# EAGLE design IO top board (EAGLE 9.6.2)
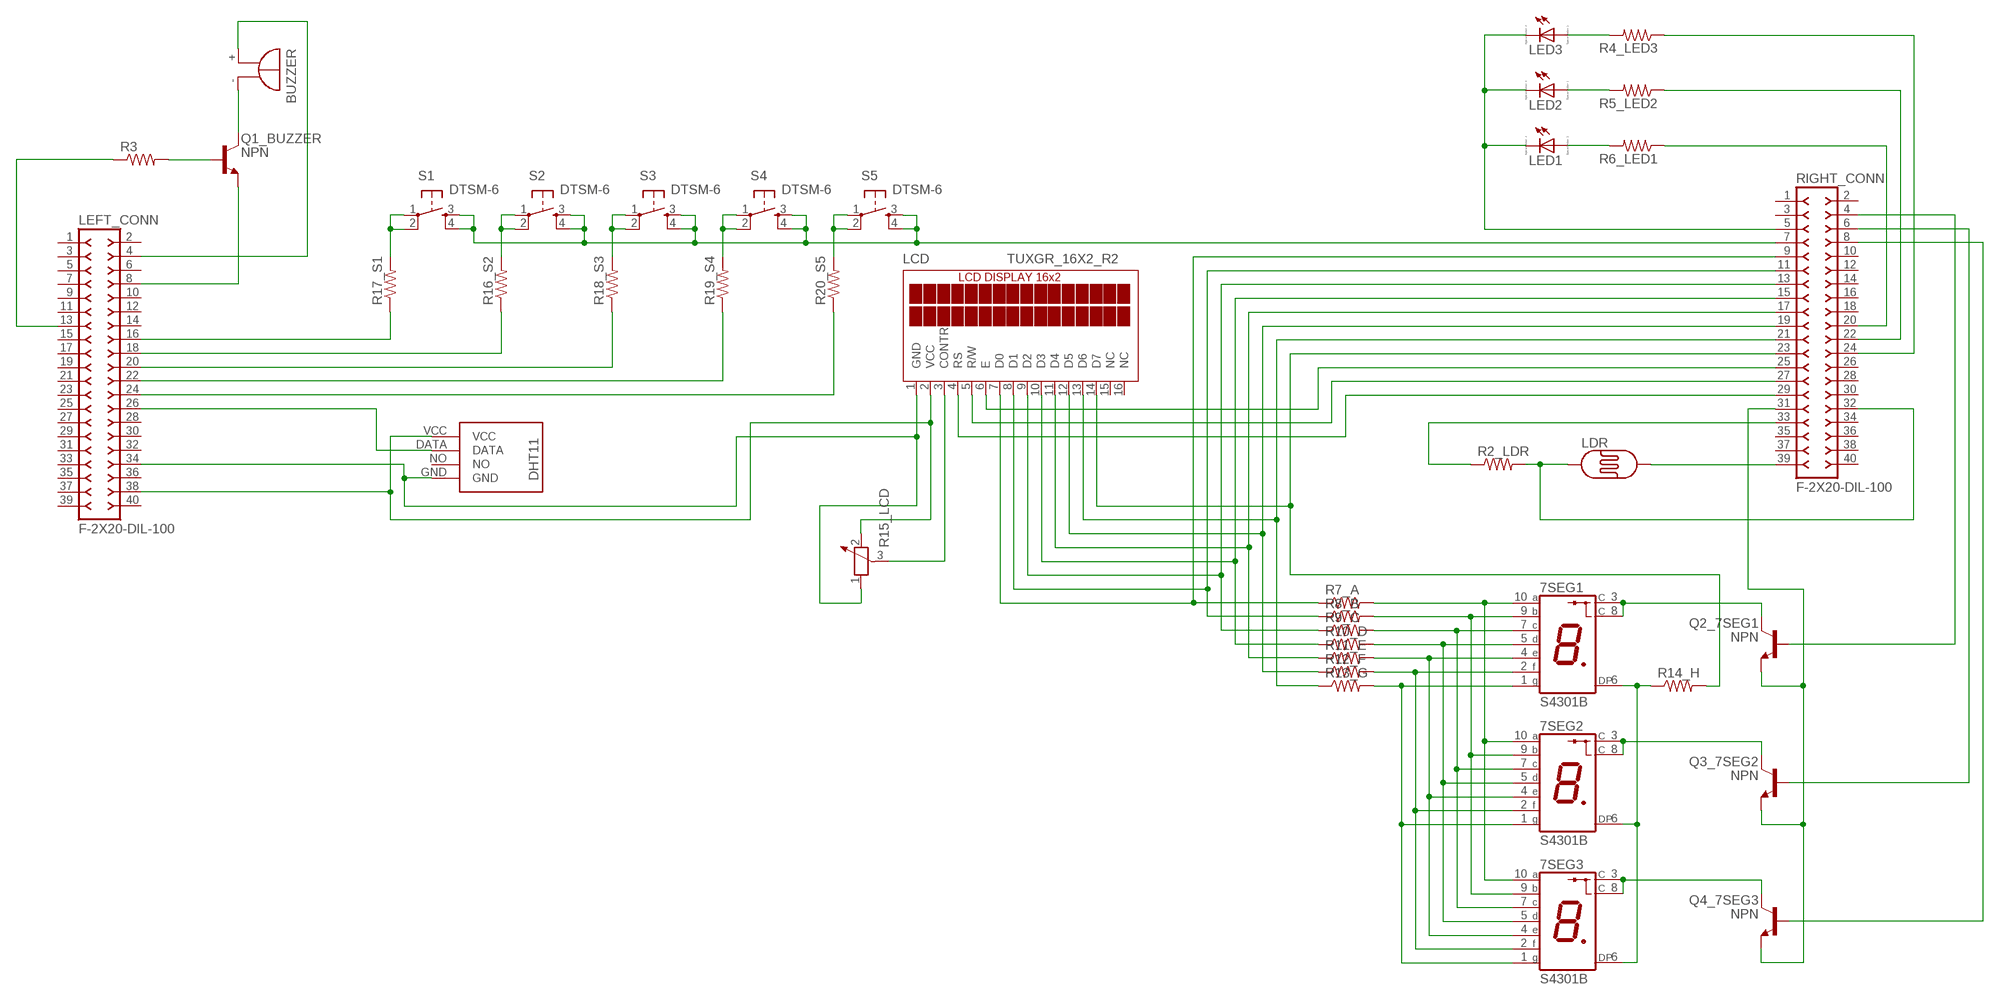
[diagram p0: schematic, sheet 1]

## Parts
7SEG1  S4301B  [S4301B]
7SEG2  S4301B  [S4301B]
7SEG3  S4301B  [S4301B]
BUZZER  EB2209A  [EB2209A]
LCD  TUXGR_16X2_R2  [TUXGR_16X2_R2]
LDR  PHOTOCELLONB  [ON_BOARD]
LED1  LED_ELD260  [LED_LD260]
LED2  LED_ELD260  [LED_LD260]
LED3  LED_ELD260  [LED_LD260]
LEFT_CONN  F-2X20-DIL-100  [DIL-100-2X20]
Q1_BUZZER  NPN  NPN_SC-70  [SC70]
Q2_7SEG1  NPN  NPN_SC-70  [SC70]
Q3_7SEG2  NPN  NPN_SC-70  [SC70]
Q4_7SEG3  NPN  NPN_SC-70  [SC70]
R2_LDR  R-US_0204/5  [0204/5]
R3  R-US_0204/5  [0204/5]
R4_LED3  R-US_0204/5  [0204/5]
R5_LED2  R-US_0204/5  [0204/5]
R6_LED1  R-US_0204/5  [0204/5]
R7_A  R-US_0204/5  [0204/5]
R8_B  R-US_0204/5  [0204/5]
R9_C  R-US_0204/5  [0204/5]
R10_D  R-US_0204/5  [0204/5]
R11_E  R-US_0204/5  [0204/5]
R12_F  R-US_0204/5  [0204/5]
R13_G  R-US_0204/5  [0204/5]
R14_H  R-US_0204/5  [0204/5]
R15_LCD  POTENTIOMETER_PT-10  [PT-10]
R16_S2  R-US_0204/5  [0204/5]
R17_S1  R-US_0204/5  [0204/5]
R18_S3  R-US_0204/5  [0204/5]
R19_S4  R-US_0204/5  [0204/5]
R20_S5  R-US_0204/5  [0204/5]
RIGHT_CONN  F-2X20-DIL-100  [DIL-100-2X20]
S1  DTSM-6  [DTSM-6]
S2  DTSM-6  [DTSM-6]
S3  DTSM-6  [DTSM-6]
S4  DTSM-6  [DTSM-6]
S5  DTSM-6  [DTSM-6]
U$1  DHT11-PION.  [DHT11-PION.]

## Nets
N$1: LDR.1 R2_LDR.2 RIGHT_CONN.32
N$2: R2_LDR.1 RIGHT_CONN.33
N$3: LDR.2 RIGHT_CONN.39
N$4: LCD.2(VCC) LEFT_CONN.38 R15_LCD.2 U$1.VCC
N$5: LCD.1(GND) LEFT_CONN.34 R15_LCD.1 U$1.GND
N$6: LEFT_CONN.26 U$1.DATA
N$7: Q1_BUZZER.2(B) R3.2
N$8: BUZZER.- Q1_BUZZER.3(C)
N$9: BUZZER.+ LEFT_CONN.4
N$10: LEFT_CONN.8 Q1_BUZZER.1(E)
N$11: LED1.A R6_LED1.2
N$12: LED2.A R5_LED2.2
N$13: LED3.A R4_LED3.2
N$14: LEFT_CONN.16 R17_S1.1
N$16: LED1.K(C) LED2.K(C) LED3.K(C) RIGHT_CONN.5
N$17: R4_LED3.1 RIGHT_CONN.24
N$18: R5_LED2.1 RIGHT_CONN.22
N$19: R6_LED1.1 RIGHT_CONN.20
N$20: 7SEG1.6(DP) 7SEG2.6(DP) 7SEG3.6(DP) R14_H.1
N$21: 7SEG1.1(G) 7SEG2.1(G) 7SEG3.1(G) R13_G.2
N$22: Q2_7SEG1.2(B) RIGHT_CONN.4
N$23: LCD.7(D0) R7_A.1 RIGHT_CONN.9
N$24: 7SEG1.10(A) 7SEG2.10(A) 7SEG3.10(A) R7_A.2
N$25: 7SEG1.9(B) 7SEG2.9(B) 7SEG3.9(B) R8_B.2
N$26: 7SEG1.7(C) 7SEG2.7(C) 7SEG3.7(C) R9_C.2
N$27: 7SEG1.5(D) 7SEG2.5(D) 7SEG3.5(D) R10_D.2
N$28: 7SEG1.4(E) 7SEG2.4(E) 7SEG3.4(E) R11_E.2
N$29: 7SEG1.2(F) 7SEG2.2(F) 7SEG3.2(F) R12_F.2
N$30: LCD.8(D1) R8_B.1 RIGHT_CONN.11
N$31: LCD.9(D2) R9_C.1 RIGHT_CONN.13
N$32: LCD.10(D3) R10_D.1 RIGHT_CONN.15
N$33: LCD.11(D4) R11_E.1 RIGHT_CONN.17
N$34: LCD.12(D5) R12_F.1 RIGHT_CONN.19
N$35: LCD.13(D6) R13_G.1 RIGHT_CONN.21
N$36: LCD.14(D7) R14_H.2 RIGHT_CONN.23
N$37: 7SEG1.3(C) 7SEG1.8(C) Q2_7SEG1.3(C)
N$38: R17_S1.2 S1.1 S1.2
N$39: LCD.3(CONTR) R15_LCD.3
N$40: 7SEG2.3(C) 7SEG2.8(C) Q3_7SEG2.3(C)
N$41: LCD.4(RS) RIGHT_CONN.29
N$42: R16_S2.2 S2.1 S2.2
N$43: LCD.6(E) RIGHT_CONN.25
N$44: LCD.5(R/W) RIGHT_CONN.27
N$45: Q2_7SEG1.1(E) Q3_7SEG2.1(E) Q4_7SEG3.1(E) RIGHT_CONN.31
N$46: 7SEG3.3(C) 7SEG3.8(C) Q4_7SEG3.3(C)
N$52: R18_S3.2 S3.1 S3.2
N$53: R19_S4.2 S4.1 S4.2
N$54: R20_S5.2 S5.1 S5.2
N$55: LEFT_CONN.18 R16_S2.1
N$56: LEFT_CONN.20 R18_S3.1
N$57: LEFT_CONN.22 R19_S4.1
N$58: LEFT_CONN.24 R20_S5.1
N$59: LEFT_CONN.13 R3.1
N$60: Q3_7SEG2.2(B) RIGHT_CONN.6
N$61: Q4_7SEG3.2(B) RIGHT_CONN.8
N$63: RIGHT_CONN.7 S1.3 S1.4 S2.3 S2.4 S3.3 S3.4 S4.3 S4.4 S5.3 S5.4
Unconnected: LCD.15(NC) LCD.16(NC) LEFT_CONN.1 LEFT_CONN.2 LEFT_CONN.3 LEFT_CONN.5 LEFT_CONN.6 LEFT_CONN.7 LEFT_CONN.9 LEFT_CONN.10 LEFT_CONN.11 LEFT_CONN.12 LEFT_CONN.14 LEFT_CONN.15 LEFT_CONN.17 LEFT_CONN.19 LEFT_CONN.21 LEFT_CONN.23 LEFT_CONN.25 LEFT_CONN.27 LEFT_CONN.28 LEFT_CONN.29 LEFT_CONN.30 LEFT_CONN.31 LEFT_CONN.32 LEFT_CONN.33 LEFT_CONN.35 LEFT_CONN.36 LEFT_CONN.37 LEFT_CONN.39 LEFT_CONN.40 RIGHT_CONN.1 RIGHT_CONN.2 RIGHT_CONN.3 RIGHT_CONN.10 RIGHT_CONN.12 RIGHT_CONN.14 RIGHT_CONN.16 RIGHT_CONN.18 RIGHT_CONN.26 RIGHT_CONN.28 RIGHT_CONN.30 RIGHT_CONN.34 RIGHT_CONN.35 RIGHT_CONN.36 RIGHT_CONN.37 RIGHT_CONN.38 RIGHT_CONN.40 U$1.NO

## Library data of the parts
7SEG1-7SEG3 = led-7-segment:S4301B: Single Digit Seven-Segment Display (cathode common) Source: LITEON .. S4301B.pdf; OC_FARNELL: unknown; OC_NEWARK: unknown
BUZZER = buzzer:EB2209A: BUZZER Source: Buerklin; OC_FARNELL: unknown; OC_NEWARK: unknown
LCD = display-lcd:TUXGR_16X2_R2: Tuxgraphics LCD display 16x2 characters reflective, without background light Source: tuxgr_12x2_r2.pdf; OC_FARNELL: unknown; OC_NEWARK: unknown
LDR = LDR:PHOTOCELL: Photo Resitor
LED1-LED3 = eagle-ltspice:LED_E: LED Source: http://www.osram.convergy.de Source: www.luxeon.com Source: www.kingbright.com; SPICEMODEL: NONE; SPICEPREFIX: D; SPICETYPE: diode
LEFT_CONN RIGHT_CONN = con-headers-jp:F-2X20-: FEMALE HEADER
Q1_BUZZER Q2_7SEG1 Q3_7SEG2 Q4_7SEG3 = Transistor:NPN: NPN - Generic; CATEGORY: Transistor; SUB-CATEGORY: BJT; THERMALLOSS: NPN
R2_LDR R3 R4_LED3 R5_LED2 R6_LED1 R7_A R8_B R9_C R10_D R11_E R12_F R13_G R14_H R16_S2 R17_S1 R18_S3 R19_S4 R20_S5 = rcl:R-US_: RESISTOR, American symbol; SPICEPREFIX: R
R15_LCD = rcl:POTENTIOMETER_: Potentiometer; SPICEMODEL: POT; SPICEPREFIX: X
S1-S5 = switch-tact:DTSM-6
U$1 = DHT11:DHT11-PION.: DHT11 Czujnik temperatury i wilgotności (widok pionowy)

## Board
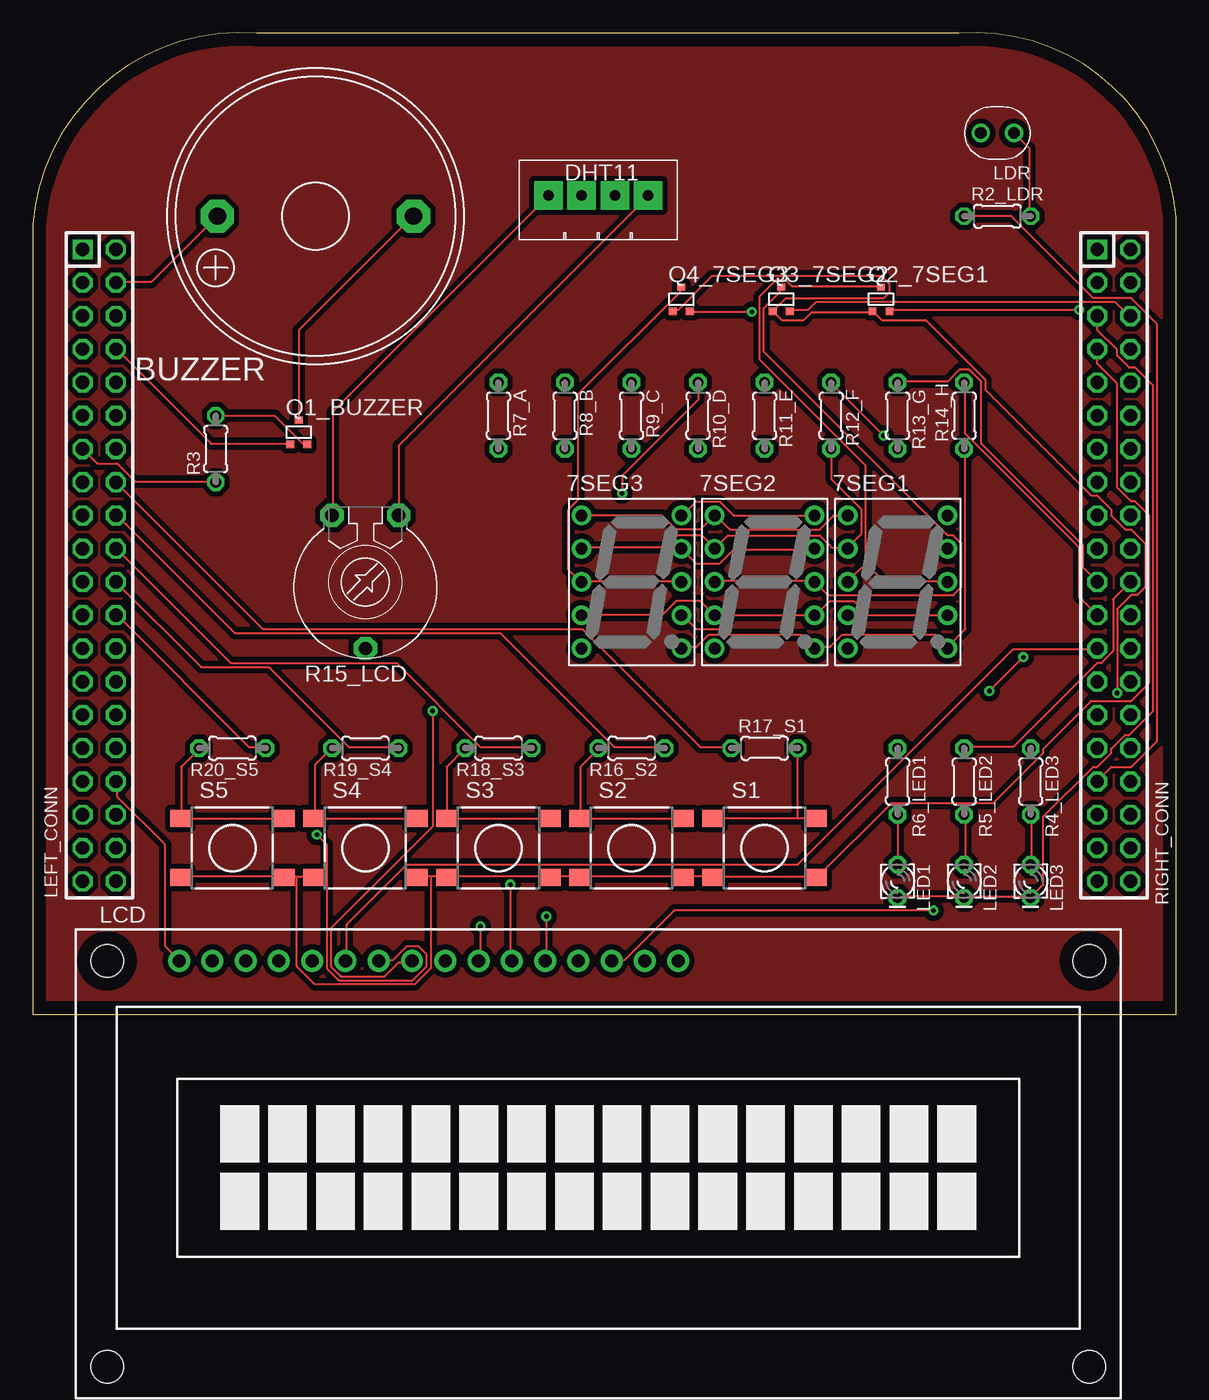
[diagram p1: board, top side]
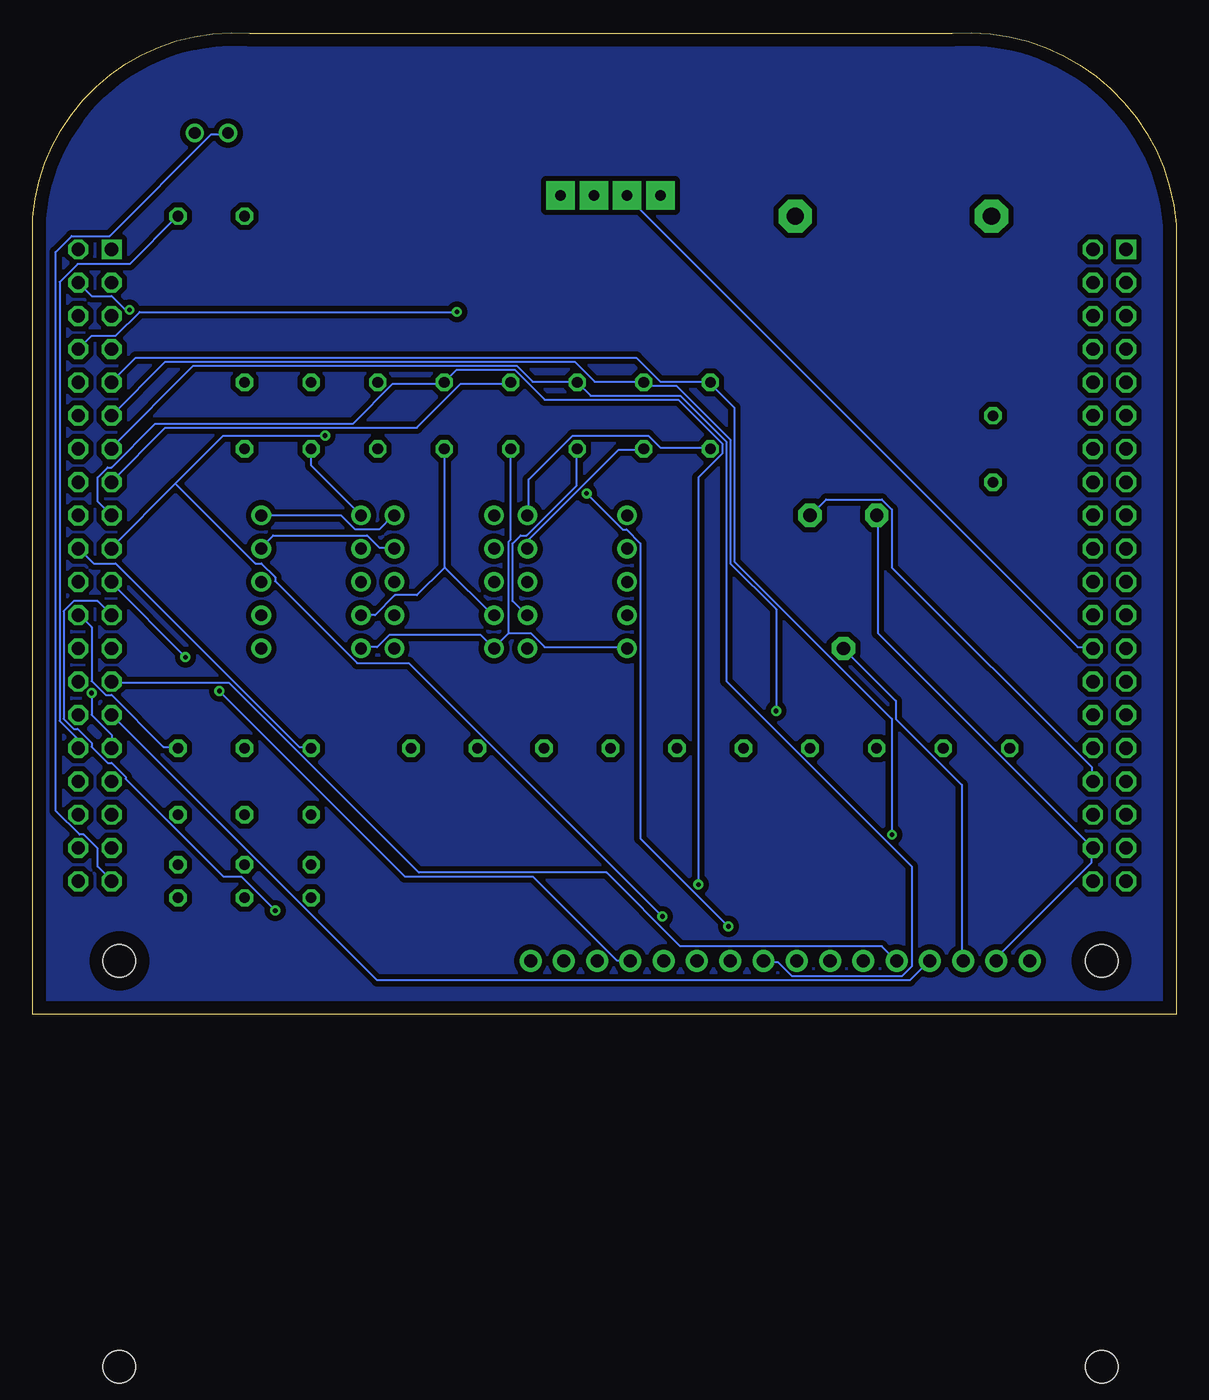
[diagram p2: board, bottom side, seen from below]

Size 87.3 x 74.97 mm. Coordinates in mm from the lower left corner, seen from the top.
Outline: 0,0 87.3,0 87.3,60.88 arc90 70.72,74.92 17.1,74.92 arc90 0,60.36 0,0
Copper layers (1*16): Top 0.035mm / dielectric 1.5mm / Bottom 0.035mm
Design rules "default": minimum track width 6mil, minimum drill 0.35mm, track to track 6mil, track to pad 6mil, pad to pad 6mil, via to via 6mil, smd to smd 6mil, copper to edge 40mil, drill to drill 6mil, minimum pad ring 10mil, minimum via ring 8mil, stop-mask expansion 4mil, vias tented up to drill 0mil, thermal gap 10mil

### Footprints (pad centres in the part's own frame; a part is rotated, then mirrored left to right if it is on the bottom)
S4301B = drill 0.9 pad 1.5: 1 -3.81,5.08; 2 -3.81,2.54; 3 -3.81,0; 4 -3.81,-2.54; 5 -3.81,-5.08; 6 3.81,-5.08; 7 3.81,-2.54; 8 3.81,0; 9 3.81,2.54; 10 3.81,5.08
EB2209A = drill 1.321 pad 2.54 octagon: + 7.493,0; - -7.493,0
TUXGR_16X2_R2 = drill 1 pad 1.676: 1 -32,15.5; 2 -29.46,15.5; 3 -26.92,15.5; 4 -24.38,15.5; 5 -21.84,15.5; 6 -19.3,15.5; 7 -16.76,15.5; 8 -14.22,15.5; 9 -11.68,15.5; 10 -9.14,15.5; 11 -6.6,15.5; 12 -4.06,15.5; 13 -1.52,15.5; 14 1.02,15.5; 15 3.56,15.5; 16 6.1,15.5 | hole 2.5: -37.5,-15.5; 37.5,-15.5; -37.5,15.5; 37.5,15.5
ON_BOARD = drill 0.9: 1 -1.27,0; 2 1.27,0
LED_LD260 = drill 0.813 octagon: A -1.27,0; K 1.27,0
DIL-100-2X20 = drill 1.016 square: 1 -24.13,-1.27 | drill 1.016 octagon: 2 -24.13,1.27; 3 -21.59,-1.27; 4 -21.59,1.27; 5 -19.05,-1.27; 6 -19.05,1.27; 7 -16.51,-1.27; 8 -16.51,1.27; 9 -13.97,-1.27; 10 -13.97,1.27; 11 -11.43,-1.27; 12 -11.43,1.27; 13 -8.89,-1.27; 14 -8.89,1.27; 15 -6.35,-1.27; 16 -6.35,1.27; 17 -3.81,-1.27; 18 -3.81,1.27; 19 -1.27,-1.27; 20 -1.27,1.27; 21 1.27,-1.27; 22 1.27,1.27; 23 3.81,-1.27; 24 3.81,1.27; 25 6.35,-1.27; 26 6.35,1.27; 27 8.89,-1.27; 28 8.89,1.27; 29 11.43,-1.27; 30 11.43,1.27; 31 13.97,-1.27; 32 13.97,1.27; 33 16.51,-1.27; 34 16.51,1.27; 35 19.05,-1.27; 36 19.05,1.27; 37 21.59,-1.27; 38 21.59,1.27; 39 24.13,-1.27; 40 24.13,1.27
SC70 = smd 0.6 x 0.55: 1 -0.65,-0.925; 2 0.65,-0.925; 3 0,0.925
0204/5 = drill 0.813 octagon: 1 -2.54,0; 2 2.54,0
PT-10 = drill 1.016 pad 1.778 octagon: 1 -2.54,-5.08; 2 2.54,-5.08; 3 0,5.08
DTSM-6 = smd 1.55 x 1.3: 1 -3.975,2.25; 2 3.975,2.25; 3 -3.975,-2.25; 4 3.975,-2.25
DHT11-PION. = drill 0.8 pad 2.184 square: DATA -1.27,0.305; GND 3.81,0.305; NO 1.27,0.305; VCC -3.81,0.305

### Placement (x,y rotation side)
7SEG1  66.04,33.02 0 top
7SEG2  55.88,33.02 0 top
7SEG3  45.72,33.02 0 top
BUZZER  21.59,60.96 180 top
LCD  43.18,-11.43 0 top
LDR  73.66,67.31 180 top
LED1  66.04,10.16 270 top
LED2  71.12,10.16 270 top
LED3  76.2,10.16 270 top
LEFT_CONN  5.08,34.29 270 top
Q1_BUZZER  20.32,44.45 0 top
Q2_7SEG1  64.77,54.61 0 top
Q3_7SEG2  57.15,54.61 0 top
Q4_7SEG3  49.53,54.61 0 top
R2_LDR  73.66,60.96 0 top
R3  13.97,43.18 90 top
R4_LED3  76.2,17.78 270 top
R5_LED2  71.12,17.78 270 top
R6_LED1  66.04,17.78 270 top
R7_A  35.56,45.72 270 top
R8_B  40.64,45.72 270 top
R9_C  45.72,45.72 270 top
R10_D  50.8,45.72 270 top
R11_E  55.88,45.72 270 top
R12_F  60.96,45.72 270 top
R13_G  66.04,45.72 270 top
R14_H  71.12,45.72 90 top
R15_LCD  25.4,33.02 180 top
R16_S2  45.72,20.32 180 top
R17_S1  55.88,20.32 0 top
R18_S3  35.56,20.32 180 top
R19_S4  25.4,20.32 180 top
R20_S5  15.24,20.32 180 top
RIGHT_CONN  82.55,34.29 270 top
S1  55.88,12.7 0 top
S2  45.72,12.7 0 top
S3  35.56,12.7 0 top
S4  25.4,12.7 0 top
S5  15.24,12.7 0 top
U$1  43.18,62.23 0 top

### Tracks (layer width: path | path; a pad name or v marks a point on that pad's centre or on a via)
GND
  pour Top (isolate 0.406): 87.63,0 0,0 0,59.69 arc-90 15.24,74.93 72.39,74.93 arc-90 87.63,59.69
  pour Bottom (isolate 0.406): 87.63,0 0,0 0,60.96 arc-90 13.97,74.93 72.39,74.93 73.66,74.93 arc-90 87.63,60.96
N$1
  Top 0.152: LDR.1 76.1,66.14 76.1,60.96 R2_LDR.2
  Bottom 0.152: RIGHT_CONN.32 83.87,20.42 83.87,21.03 85.24,22.4 85.24,55.93 83.87,57.3 79.91,57.3 76.25,60.96 R2_LDR.2
N$2
  Top 0.152: R2_LDR.1 74.73,60.96 80.98,54.71 83.87,54.71 85.85,52.73 85.85,20.88 83.87,18.9 82.35,18.9 81.28,17.83 RIGHT_CONN.33
N$3
  Bottom 0.152: LDR.2 72.44,67.21 73.66,67.21 81.43,59.44 84.33,59.44 85.55,58.22 85.55,15.54 83.72,13.72 83.41,13.72 82.35,12.65 82.35,11.28 81.28,10.21 RIGHT_CONN.39
N$4
  Top 0.152: R15_LCD.2 22.91,38.1 22.91,46.02 39.37,62.48 U$1.VCC
  Bottom 0.152: LCD.2 13.61,4.12 13.61,4.42 6.45,11.58 6.45,12.65 LEFT_CONN.38 22.76,29.11 22.76,38.1 R15_LCD.2
N$5
  Top 0.152: LEFT_CONN.34 6.45,17.68 6.45,16.61 10.11,12.95 10.11,5.18 11.18,4.12 LCD.1 | R15_LCD.1 27.94,43.43 46.99,62.48 U$1.GND
  Bottom 0.152: R15_LCD.1 26.72,39.32 22.45,39.32 21.69,38.56 21.69,34.14 6.45,18.9 6.45,17.83 LEFT_CONN.34
N$6
  Bottom 0.152: LEFT_CONN.26 6.45,28.04 7.52,28.04 41.96,62.48 U$1.DATA
N$7
  Top 0.152: R3.2 18.49,45.72 20.62,43.59 20.93,43.59 Q1_BUZZER.2
N$8
  Top 0.152: Q1_BUZZER.3 20.32,52.27 29.01,60.96 BUZZER.-
N$9
  Top 0.152: LEFT_CONN.4 6.45,55.93 9.04,55.93 14.07,60.96 BUZZER.+
N$10
  Top 0.152: Q1_BUZZER.1 19.56,43.59 13.61,43.59 6.45,50.75 LEFT_CONN.8
N$11
  Top 0.152: R6_LED1.2 LED1.A
N$12
  Top 0.152: LED2.A 71.22,11.43 71.22,15.24 R5_LED2.2
N$13
  Top 0.152: LED3.A 76.25,11.43 76.25,15.24 R4_LED3.2
N$14
  Top 0.152: LEFT_CONN.16 17.58,29.41 41.96,29.41 50.95,20.42 53.24,20.42 R17_S1.1
N$16
  Top 0.152: LED1.K 66.04,8.99 71.07,8.99 LED2.K 71.22,8.99 76.1,8.99 LED3.K 76.25,8.99 77.17,9.91 77.17,15.09 80.98,18.9 81.28,18.9 82.35,19.96 82.35,20.27 83.41,21.34 83.72,21.34 85.55,23.16 85.55,48.01 84.18,49.38 83.72,49.38 82.8,50.29 82.8,50.75 81.28,52.27 RIGHT_CONN.5
N$17
  Bottom 0.152: R4_LED3.1 76.25,20.42 77.32,20.42 81.28,24.38 81.74,24.38 82.8,25.45 82.8,29.57 83.72,30.48 RIGHT_CONN.24
N$18
  Top 0.152: RIGHT_CONN.22 82.5,31.7 82.5,27.74 81.59,26.82 81.28,26.82 74.88,20.42 71.22,20.42 R5_LED2.1
N$19
  Bottom 0.152: R6_LED1.1 66.04,20.42 66.95,20.42 80.98,34.44 82.65,34.44 83.72,35.51 RIGHT_CONN.20
N$20
  Top 0.152: 7SEG3.6 49.58,28.04 50.65,28.04 51.56,28.96 58.73,28.96 59.64,28.04 7SEG2.6 59.79,28.04 60.86,28.04 61.77,28.96 68.94,28.96 69.85,28.04 | 69.85,28.04 71.22,29.41 71.22,43.13 R14_H.1 | 69.85,28.04 7SEG1.6
N$21
  Top 0.152: 7SEG3.1 48.06,38.1 49.12,37.03 50.95,37.03 52.02,38.1 7SEG2.1 52.17,38.1 53.24,37.03 60.1,37.03 61.16,38.1 7SEG1.1
  Bottom 0.152: R13_G.2 66.04,41.91 7SEG1.1
N$22  (via drill 0.35)
  Top 0.152: v79.91,53.8 65.43,53.8 Q2_7SEG1.2
  Bottom 0.152: v79.91,53.8 80.21,53.8 81.28,54.86 82.8,54.86 RIGHT_CONN.4
N$23  (via drill 0.35)
  Top 0.152: v21.69,13.72 22.45,12.95 22.45,3.5 23.37,2.59 29.01,2.59 30.07,3.66 30.07,4.57 29.46,5.18 28.55,5.18 27.48,4.12 26.57,4.12 LCD.7
  Bottom 0.152: RIGHT_CONN.9 81.28,48.31 79.45,50.14 41.2,50.14 39.37,48.31 35.56,48.31 R7_A.1 35.56,48.16 33.73,46.33 33.73,34.59 21.69,22.55 v21.69,13.72
N$24
  Top 0.152: 7SEG2.10 53.54,38.1 52.48,39.17 50.65,39.17 49.58,38.1 7SEG3.10
  Bottom 0.152: R7_A.2 35.56,43.28 39.37,43.28 40.28,44.2 46.08,44.2 49.43,40.84 49.43,38.1 7SEG3.10 | 7SEG1.10 63.75,38.1 62.69,37.03 60.86,37.03 59.79,38.1 7SEG2.10
N$25
  Top 0.152: 7SEG3.9 50.65,34.44 52.48,34.44 53.54,35.51 59.64,35.51 7SEG2.9
  Bottom 0.152: 7SEG2.9 59.79,35.66 60.86,35.66 61.77,36.58 68.94,36.58 69.85,35.66 7SEG1.9 | R8_B.2 40.74,43.13 42.57,43.13 49.43,36.27 49.43,35.66 7SEG3.9
N$26
  Top 0.152: 7SEG3.7 49.58,30.48 50.65,29.41 52.48,29.41 53.54,30.48 7SEG2.7 59.79,30.48 60.86,31.55 62.69,31.55 63.75,30.48 7SEG1.7
  Bottom 0.152: R9_C.2 45.77,43.13 45.77,40.39 49.58,36.58 50.04,36.58 50.65,35.97 50.65,31.55 49.58,30.48 7SEG3.7
N$27
  Bottom 0.152: R10_D.2 50.8,36.27 50.95,36.12 50.95,29.11 | 50.95,29.11 52.02,28.04 7SEG2.5 53.09,28.96 60.1,28.96 61.01,28.04 62.23,28.04 7SEG1.5 | 50.95,29.11 49.28,29.11 48.21,28.04 41.96,28.04 7SEG3.5
N$28
  Top 0.152: 7SEG3.4 48.06,30.48 49.12,31.55 50.95,31.55 52.02,30.48 7SEG2.4
  Bottom 0.152: 55.83,34.14 55.83,43.13 R11_E.2 | 55.83,34.14 52.17,30.48 7SEG2.4 | 7SEG1.4 61.16,30.48 59.64,32 57.96,32 55.83,34.14
N$29
  Top 0.152: 62.23,35.66 63.3,36.73 63.3,38.56 61.01,40.84 61.01,43.13 R12_F.2 | 7SEG3.2 41.96,35.66 48.21,35.66 49.12,36.58 51.1,36.58 52.02,35.66 7SEG2.2 53.09,36.58 60.1,36.58 61.01,35.66 62.23,35.66 | 62.23,35.66 7SEG1.2
N$30  (via drill 0.35)
  Top 0.152: v30.53,23.16 30.53,14.33 22.76,6.55 22.76,3.66 23.52,2.9 26.87,2.9 27.94,3.96 28.85,3.96 LCD.8
  Bottom 0.152: RIGHT_CONN.11 77.17,49.84 45.92,49.84 44.4,48.31 40.74,48.31 R8_B.1 40.59,48.16 40.44,48.01 38.15,48.01 34.04,43.89 34.04,34.44 30.53,30.94 v30.53,23.16
N$31
  Bottom 0.152: RIGHT_CONN.13 81.28,43.28 75.03,49.53 50.34,49.53 49.12,48.31 45.77,48.31 R9_C.1 44.7,47.24 37.85,47.24 34.34,43.74 34.34,25.45 20.17,11.28 20.17,3.66 20.93,2.9 29.31,2.9 30.38,3.96 31.45,3.96 LCD.9
N$32  (via drill 0.35)
  Top 0.152: v34.19,6.71 34.19,4.12 LCD.10 | v45.01,39.78 45.01,41.15 50.8,46.94 R10_D.1
  Bottom 0.152: R10_D.1 50.8,48.16 54.61,48.16 57.96,44.81 77.17,44.81 81.28,40.69 RIGHT_CONN.15 | v34.19,6.71 40.89,13.41 40.89,35.97 41.96,37.03 42.27,37.03 v45.01,39.78
N$33  (via drill 0.35)
  Top 0.152: v36.47,9.91 36.47,4.12 LCD.11
  Bottom 0.152: RIGHT_CONN.17 82.35,39.17 82.35,41 81.59,41.76 81.28,41.76 77.93,45.11 62.84,45.11 59.79,48.16 55.98,48.16 R11_E.1 54.91,49.23 50.49,49.23 48.21,46.94 38,46.94 34.65,43.59 34.65,42.82 36.47,41 v36.47,9.91
N$34  (via drill 0.35)
  Top 0.152: v64.97,44.2 61.01,48.16 R12_F.1 | v39.22,7.47 39.22,4.12 LCD.12
  Bottom 0.152: v64.97,44.2 72.75,44.2 76.4,40.54 | 76.4,40.54 81.28,35.66 RIGHT_CONN.19 | v39.22,7.47 58.57,26.82 62.54,26.82 68.78,33.07 68.78,33.38 69.85,34.44 70.31,34.44 76.4,40.54
N$35  (via drill 0.35)
  Top 0.152: R13_G.1 66.04,48.31 69.85,48.31 70.76,49.23 71.53,49.23 72.44,48.31 72.44,43.59 80.21,35.81 80.21,34.14 81.28,33.07 RIGHT_CONN.21 | v75.64,27.28 v73.05,24.69
  Bottom 0.152: v73.05,24.69 58.88,10.52 49.12,10.52 42.72,4.12 41.81,4.12 LCD.13 | v75.64,27.28 81.28,32.92 RIGHT_CONN.21
N$36  (via drill 0.35)
  Top 0.152: RIGHT_CONN.23 79.91,31.85 79.91,35.66 71.22,44.35 71.22,48.16 R14_H.2 | v68.78,7.92 48.97,7.92 45.16,4.12 44.25,4.12 LCD.14
  Bottom 0.152: v68.78,7.92 71.37,10.52 72.75,10.52 80.21,17.98 80.21,18.14 81.28,19.2 81.59,19.2 82.8,20.42 82.8,20.73 83.87,21.79 84.18,21.79 84.94,22.55 84.94,30.79 84.18,31.55 82.35,31.55 RIGHT_CONN.23
N$37
  Top 0.152: 63.6,34.44 63.6,41.91 55.52,49.99 55.52,54.86 56.74,56.08 57.51,56.08 57.96,55.63 64.67,55.63 Q2_7SEG1.3 | 63.6,34.44 62.23,33.07 7SEG1.3 | 63.6,34.44 64.97,33.07 69.85,33.07 7SEG1.8
N$38
  Top 0.152: 58.42,14.94 59.79,14.94 S1.2 | 58.42,14.94 52.02,14.94 S1.1 | 58.42,14.94 R17_S1.2
N$39
  Bottom 0.152: R15_LCD.3 21.39,23.93 21.39,22.55 16.36,17.53 16.36,4.12 LCD.3
N$40
  Top 0.152: Q3_7SEG2.3 57.05,55.47 57.05,55.17 55.83,53.95 55.83,50.6 69.85,36.58 70.31,36.58 70.92,35.97 70.92,32.61 70.31,32 60.71,32 7SEG2.8 59.64,33.07 52.17,33.07 7SEG2.3
N$41
  Bottom 0.152: RIGHT_CONN.29 61.01,2.59 20.32,2.59 18.95,3.96 LCD.4
N$42
  Top 0.152: R16_S2.2 43.18,20.27 41.81,18.9 41.81,15.09 S2.1 41.81,14.94 49.58,14.94 S2.2
N$43
  Top 0.152: RIGHT_CONN.25 81.28,27.89 74.88,27.89 58.42,11.43 28.55,11.43 23.98,6.86 23.98,4.12 LCD.6
N$44
  Bottom 0.152: RIGHT_CONN.27 81.28,25.3 72.29,25.3 57.81,10.82 43.48,10.82 37.85,5.18 22.45,5.18 21.39,4.12 LCD.5
N$45  (via drill 0.35)
  Top 0.152: Q4_7SEG3.1 48.97,53.8 49.28,53.8 51.87,56.39 64.82,56.39 65.43,55.78 65.43,55.17 64.97,54.71 57.51,54.71 56.59,53.8 Q3_7SEG2.1 56.59,53.65 57.2,53.03 58.88,53.03 59.49,53.65 64.06,53.65 Q2_7SEG1.1 64.21,53.65 64.82,53.03 68.17,53.03 72.75,48.46 72.75,47.7 80.82,39.62 81.28,39.62 82.35,38.56 82.35,38.1 83.41,37.03 83.87,37.03 84.94,35.97 84.94,32.61 84.33,32 83.87,32 82.8,30.94 v82.8,24.54
  Bottom 0.152: RIGHT_CONN.31 81.28,21.34 82.8,22.86 v82.8,24.54
N$46
  Top 0.152: Q4_7SEG3.3 49.43,55.47 49.43,55.17 41.66,47.4 41.66,39.32 40.89,38.56 40.89,33.98 41.81,33.07 7SEG3.3 41.96,33.07 49.43,33.07 7SEG3.8
N$52
  Top 0.152: R18_S3.2 31.6,18.9 31.6,15.09 S3.1 31.6,14.94 39.52,14.94 S3.2
N$53
  Top 0.152: R19_S4.2 22.76,20.27 21.54,19.05 21.54,15.09 S4.1 21.54,14.94 29.31,14.94 S4.2
N$54
  Top 0.152: R20_S5.2 12.7,20.27 11.33,18.9 11.33,15.09 S5.1 11.33,14.94 19.1,14.94 S5.2
N$55
  Top 0.152: R16_S2.1 48.21,20.42 44.4,20.42 35.71,29.11 15.44,29.11 6.45,38.1 LEFT_CONN.18
N$56
  Top 0.152: R18_S3.1 38,20.42 34.19,20.42 27.79,26.82 15.14,26.82 6.45,35.51 LEFT_CONN.20
N$57
  Top 0.152: LEFT_CONN.22 12.85,26.52 18.03,26.52 24.13,20.42 27.94,20.42 R19_S4.1
N$58
  Top 0.152: R20_S5.1 17.73,20.42 16.51,20.42 6.45,30.48 LEFT_CONN.24
N$59
  Top 0.152: LEFT_CONN.13 4.93,42.06 6.45,42.06 7.82,40.69 13.92,40.69 R3.1
N$60
  Top 0.152: Q3_7SEG2.2 57.81,53.8 59.18,53.8 59.79,54.41 82.65,54.41 83.72,53.34 RIGHT_CONN.6
N$61  (via drill 0.35)
  Top 0.152: v54.91,53.65 50.19,53.65 Q4_7SEG3.2
  Bottom 0.152: v54.91,53.65 79.15,53.65 80.98,51.82 82.8,51.82 RIGHT_CONN.8
N$63
  Top 0.152: S5.3 11.33,10.52 19.1,10.52 S5.4 19.25,10.52 20.17,10.52 | 20.17,10.52 21.39,10.52 S4.3 | 30.38,10.52 31.45,10.52 S3.3 31.6,10.52 39.52,10.52 S3.4 39.67,10.52 41.66,10.52 S2.3 41.81,10.52 49.58,10.52 S2.4 49.73,10.52 51.87,10.52 S1.3 52.02,10.52 59.79,10.52 S1.4 59.94,10.52 65.58,16.15 73.36,16.15 77.17,19.96 77.17,20.27 80.82,23.93 83.87,23.93 85.24,25.3 85.24,38.1 84.18,39.17 83.87,39.17 82.8,40.23 82.8,48.16 81.28,49.68 RIGHT_CONN.7 | 30.38,10.52 29.46,10.52 S4.4 | 20.17,10.52 20.17,3.66 21.54,2.29 29.16,2.29 30.38,3.5 30.38,10.52

### Text on the board
Document: IO TOP BOARD